# Altium schematic sheet [00]_NekooradGroup.SchDoc
size A
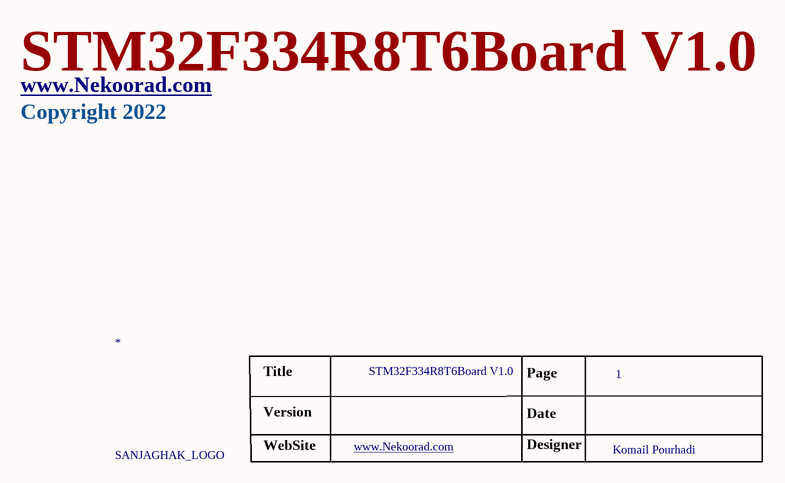
[diagram p0: [00]_NekooradGroup.SchDoc]

## Parts
*  SANJAGHAK_LOGO  [SANJAGHAK_LOGO]

## Notes on the sheet
- STM32F334R8T6Board V1.0
- www.Nekoorad.com <http://www.Nekoorad.com>
- Copyright 2022
- Title
- Page
- 1
- Version
- WebSite
- Date
- Designer
- Komail Pourhadi